# Altium schematic sheet DCDC.schdoc: =
size A3; Symbol: Sheet-Symbol_A4; Company: 嘉立创EDA; Version: V1.0; Page Size: A4; @Project Name: RK3568B2地瓜派; @Page Count: 27; @Update Date: 2025-09-13; @Create Date: 2025-09-11; @Schematic Name: Schematic1; @Page No: 15; @Page Name: DCDC; Device: Sheet-Symbol_A4; Border: 1; Title Block Position: 3; Width: 2338; Height: 1652; Region Start: 1; X Region Count: 6; Y Region Count: 4; Blade Width: 10; @Board Name: Board1; @Create Time: 22:14:46; @Update Time: 14:11:51; Organization: ORGANIZATION; Address1: ADDRESS 1; Address2: ADDRESS 2; Address3: ADDRESS 3; Address4: ADDRESS 4; SheetNumber: 5; SheetTotal: 28
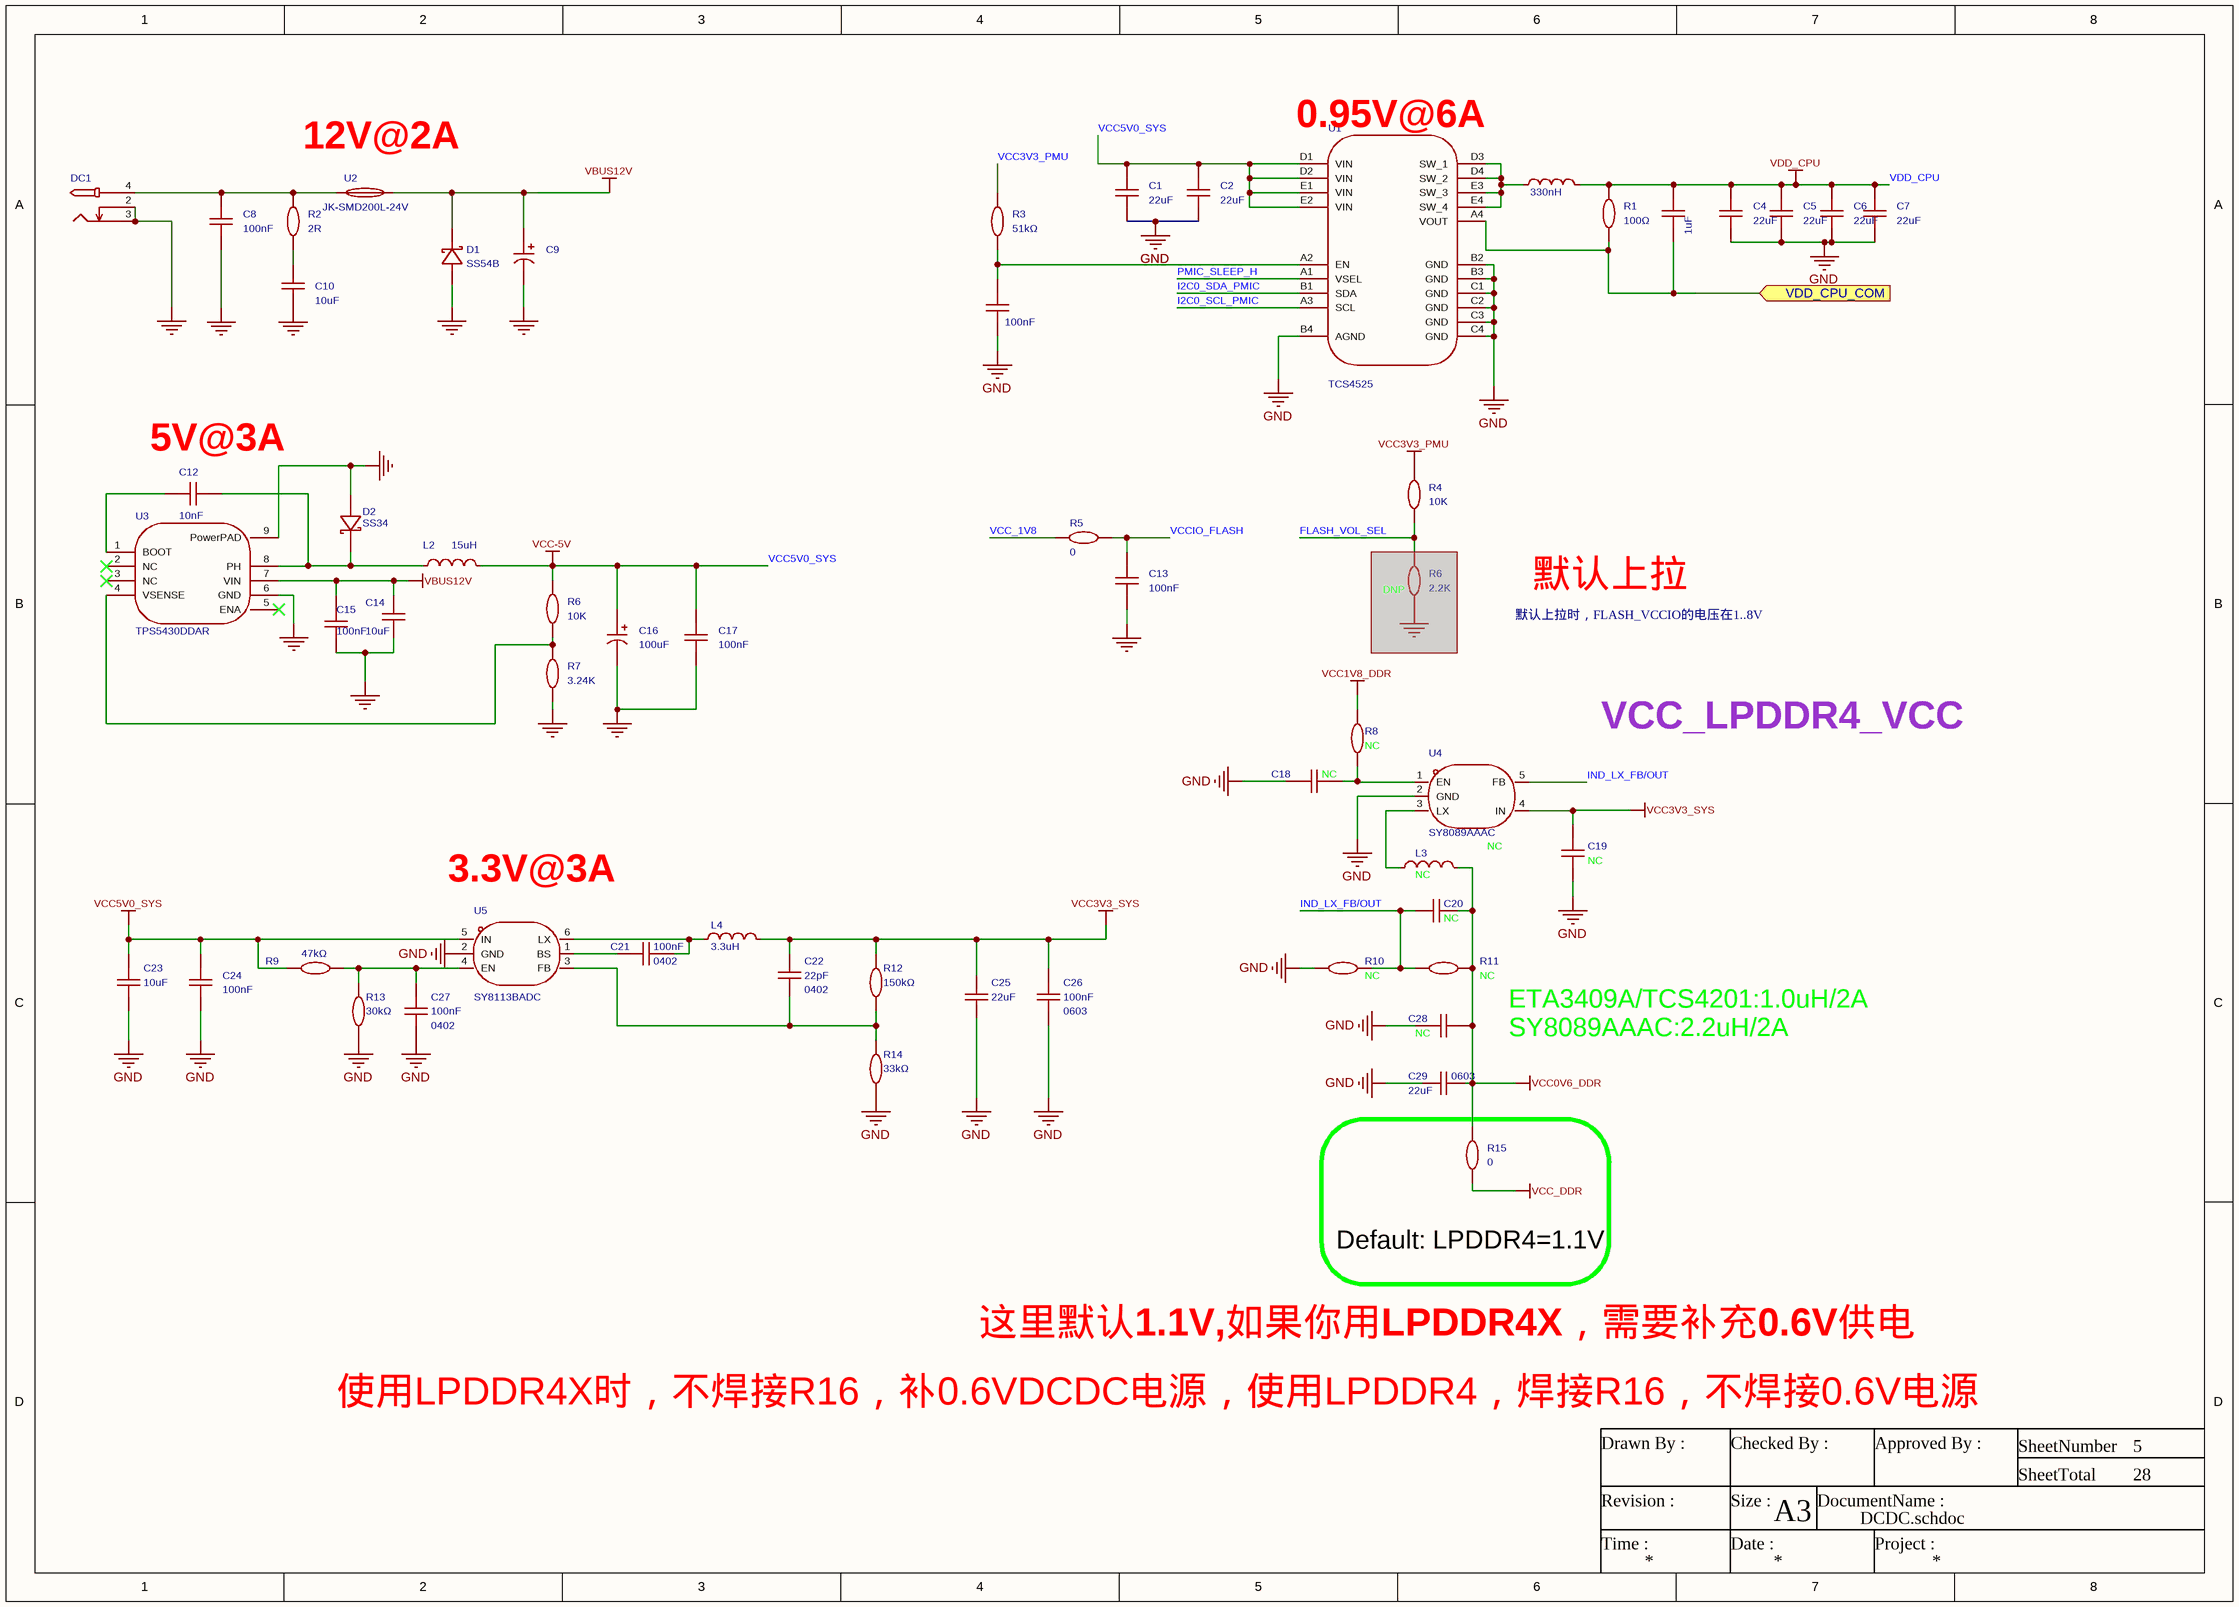
[diagram p0: DCDC.schdoc]

## Parts
(Parts that share a designator on the sheet are numbered #1, #2 ... from top to bottom, then left to right.)
C1  22uF  [C0805]
C2  22uF  [C0805]
C3  value 1uF  [MYC0402]  (hidden comment: CC0603KRX7R9BB104)
C4  22uF  [C0603]
C5  22uF  [C0603]
C6  22uF  [C0603]
C7  22uF  [C0603]
C8  100nF  [C0603]
C9  100uF  [CAP-SMD_BD6.3-L6.6-W6.6-RD]  (value not drawn)
C10  10uF  [C1206]
C11  value 100nF  [MYC0402]  (hidden comment: CC0603KRX7R9BB104)
C12  10nF  [C0603]
C13  100nF  [C0603]
C14  10uF  [C1206]
C15  100nF  [C1206]
C16  100uF  [CAP-SMD_BD6.3-L6.6-W6.6-RD]
C17  100nF  [C0603]
C18  NC  [R0402]
C19  NC  [R0603]
C20  NC  [R0402]
C21  100nF  Supplier Footprint: 0402  [MYC0402]
C22  22pF  Supplier Footprint: 0402  [R0402]
C23  10uF  [C0603]
C24  100nF  [C0603]
C25  22uF  [C0603]
C26  100nF  Supplier Footprint: 0603  [C0603]
C27  100nF  Supplier Footprint: 0402  [MYC0402]
C28  NC  [R0603]
C29  22uF  Supplier Footprint: 0603  [C0603]
D1  SS54B  [SMB_L4.6-W3.6-LS5.3-RD]
D2  SS34  [SMA_L4.3-W2.6-LS5.0-FD]
DC1  (no value)  [DC-2.0]
L1  330nH  [IND-SMD_L2.5-W2.0_WPN252012H]
L2  15uH  [IND-SMD_L7.3-W6.8]
L3  NC  [IND-SMD_L3.0-W3.0]
L4  3.3uH  [IND-SMD_L4.4-W4.2]
R1  100Ω  [R0402]
R2  2R  [R0603]
R3  51kΩ  [R0402]
R4  10K  [R0402]
R5  0  [R0603]
R6#1  2.2K  [R0201]  (graphical)  (masked out: inside a compile mask, not in the netlist)
R6#2  10K  [R0603]
R7  3.24K  [R0603]
R8  NC  [R0402]
R9  47kΩ  [R0402]
R10  NC  [R0402]
R11  NC  [R0402]
R12  150kΩ  [R0402]
R13  30kΩ  [R0402]
R14  33kΩ  [R0402]
R15  0  [R0603]
U1  TCS4525  [TCS4525]
U2  JK-SMD200L-24V  [F2920]
U3  TPS5430DDAR  [ESOP-8_L4.9-W3.9-P1.27-LS6.0-TL-EP]
U4  SY8089AAAC  [SOT-23-5_L3.0-W1.7-P0.95-LS2.8-BR]
U5  SY8113BADC  [TSOT-23-6_L2.9-W1.6-P0.95-LS2.8-BR]

## Blocks framed on the sheet
Default: LPDDR4=1.1V: R15

## Ports
VDD_CPU_COM (in)

## Nets
GND: C1.1 C2.1 C4.1 C5.1 C6.1 C7.1 C8.1 C9.2 C10.1 C11.1 C13.1 C14.1 C15.1 C16.2 C17.1 C18.2 C19.1 C23.1 C24.1 C25.1 C26.1 C27.1 C28.2 C29.2 D1.2(A) D2.1(A) DC1.2 DC1.3 R7.1 R10.2 R13.1 R14.1 U1.B2(GND) U1.B3(GND) U1.B4(AGND) U1.C1(GND) U1.C2(GND) U1.C3(GND) U1.C4(GND) U3.6(GND) U3.9(PowerPAD) U4.2(GND) U5.2(GND)
VBUS12V: C9.1 C14.2 C15.2 D1.1(K) U2.2 U3.7(VIN)
VCC0V6_DDR: C20.2 C28.1 C29.1 L3.2 R11.1 R15.2
VCC1V8_DDR: R8.2
VCC3V3_PMU: R3.2 R4.2
VCC3V3_SYS: C19.2 C22.2 C25.2 C26.2 L4.2 R12.2 U4.4(IN)
VCC5V0_SYS: C1.2 C2.2 C16.1 C17.2 C23.2 C24.2 L2.2 R6#2.2 R9.2 U1.D1(VIN) U1.D2(VIN) U1.E1(VIN) U1.E2(VIN) U5.5(IN)  [also labelled VCC-5V]
VCC_DDR: R15.1
VDD_CPU: C3.2 C4.2 C5.2 C6.2 C7.2 L1.2 R1.2
FLASH_VOL_SEL: R4.1
I2C0_SCL_PMIC: U1.A3(SCL)
I2C0_SDA_PMIC: U1.B1(SDA)
IND_LX_FB/OUT: C20.1 R10.1 R11.2 U4.5(FB)
PMIC_SLEEP_H: U1.A1(VSEL)
VCC_1V8: R5.1
VCCIO_FLASH: C13.2 R5.2
VDD_CPU_COM: C3.1 R1.1 U1.A4(VOUT) ; port VDD_CPU_COM
NetC8_2: C8.2 DC1.4 R2.2 U2.1
NetC10_2: C10.2 R2.1
NetC11_2: C11.2 R3.1 U1.A2(EN)
NetC12_1: C12.1 U3.1(BOOT)
NetC12_2: C12.2 D2.2(K) L2.1 U3.8(PH)
NetC18_1: C18.1 R8.1 U4.1(EN)
NetC21_1: C21.1 L4.1 U5.6(LX)
NetC21_2: C21.2 U5.1(BS)
NetC22_1: C22.1 R12.1 R14.2 U5.3(FB)
NetC27_2: C27.2 R9.1 R13.2 U5.4(EN)
NetL1_1: L1.1 U1.D3(SW_1) U1.D4(SW_2) U1.E3(SW_3) U1.E4(SW_4)
NetL3_1: L3.1 U4.3(LX)
NetR6#2_1: R6#2.1 R7.2 U3.4(VSENSE)

Not connected (* = marked no-connect by the designer): U3 2(NC)* 3(NC)* 5(ENA)*

## Notes on the sheet
- (near U2) 12V@2A
- (near U1) 0.95V@6A
- (near C12) 5V@3A
- 默认上拉
- (near R6#1) DNP
- 默认上拉时，FLASH_VCCIO的电压在1..8V
- VCC_LPDDR4_VCC
- 3.3V@3A
- NC
- ETA3409A/TCS4201:1.0uH/2A
  SY8089AAAC:2.2uH/2A
- 这里默认1.1V,如果你用LPDDR4X，需要补充0.6V供电
- 使用LPDDR4X时，不焊接R16，补0.6VDCDC电源，使用LPDDR4，焊接R16，不焊接0.6V电源
- Drawn By :
- Checked By :
- Approved By :
- SheetNumber
- SheetTotal
- Revision :
- Time :
- Size :
- Date :
- A3
- DocumentName :
- Project :

## Library data of the parts
C1 C2 = CAP_0805: Symbol: Capacitance; ConvertToPcb: yes; ModelId: 1ba041120af144c991958decab20d241聨0819f05c4eef4c71ace90d822a990e87; ModelName: C0805_L2.0-W1.3-H1.3; ModelTransform: 78.74,51.181,0,0,0,0,0,0.0005,0; Device: CAP_0805; Value: 22uF; AddInBom: yes; Supplier Footprint: 0805; FootprintName: C0805
C3 C11 = CC0603KRX7R9BB104: 容值:100nF;精度:±10%;额定电压:50V;材质(温度系数):X7R;; Manufacturer: YAGEO(国巨); Symbol: CapAcitance; AddInBom: yes; ModelId: ac125912035d415993ca9572d50418b1; ModelName: C0603_L1.6-W0.8-H0.8; ModelTransform: 62.992,31.496,0,0,0,0,0,0,0; Tolerance: ±10%; Voltage Rated: 50V; Temperature Coefficient: X7R; Device: CC0603KRX7R9BB104; LCSC Part Name: 100nF ±10% 50V; ManufacturerPart: CC0603KRX7R9BB104; Supplier Footprint: 0603; JLCPCB Part Class: Basic Part; Datasheet: https://atta.szlcsc.com/upload/public/pdf/source/20180910/C282072_33301C7F631E79921B82A8DAC6BCC5B3.pdf; Supplier: LCSC; ConvertToPcb: yes; FootprintName: MYC0402
  C11: SupplierPart: C14663
C4-C7 = CAP_0603: Symbol: Capacitance; ConvertToPcb: yes; ModelId: ac125912035d415993ca9572d50418b1聨0819f05c4eef4c71ace90d822a990e87; ModelName: C0603_L1.6-W0.8-H0.8; ModelTransform: 62.992,31.496,0,0,0,0,0,0,0; Device: CAP_0603; Value: 22uF; AddInBom: yes; Supplier Footprint: 0603; FootprintName: C0603
C8 C13 C15 C17 = CAP_0603: ConvertToPcb: yes; SymbolName: Capacitance; ModelId: ac125912035d415993ca9572d50418b1; ModelName: C0603_L1.6-W0.8-H0.8; ModelTransform: 62.992,31.496,0,0,0,0,0,0,0; Device: CAP_0603; AddInBom: yes; Supplier Footprint: 0603; Value: 100nF
  C8 C13 C17: FootprintName: C0603
  C15: FootprintName: C1206
C9 C16 = MA35V100M6X8: 容值:100uF;精度:±20%;额定电压:35V;纹波电流:2.9A@100kHz;等效串联电阻(ESR):30mΩ@100kHz;类型:聚合物;; Manufacturer: 捷而瑞; AddInBom: yes; ModelId: 901941a22e384f799727a46cfda77174; ModelName: CAP-SMD_L6.6-W6.6-H7.0-LS7.2; ModelTransform: 307.086,259.842,0,0,0,0,0,0,0; Tolerance: ±20%; Voltage Rating: 35V; Type: 聚合物; Lifetime: 2000hrs@105℃; Symbol: MA35V100M6X8; Device: MA35V100M6X8; LCSC Part Name: 100uF ±20% 35V; SupplierPart: C46550467; ManufacturerPart: MA35V100M6X8; Supplier Footprint: SMD,D6.3xL7.7mm; JLCPCB Part Class: 扩展库; Datasheet: https://item.szlcsc.com/datasheet/MA35V100M6X8/48680161.html; Supplier: LCSC; ConvertToPcb: yes; FootprintName: CAP-SMD_BD6.3-L6.6-W6.6-RD; Value: 100uF; Ripple Current: 2.9A@100kHz; Equivalent Series Resistance(ESR): 30mΩ@100kHz; Diameter: 6.3mm; Height - Seated (Max): 7mm; Operating Temperature: -55℃~+105℃
C10 C14 = CL31A106KBHNNNE: 容值:10uF;精度:±10%;额定电压:50V;温度系数:X5R;; Manufacturer: SAMSUNG(三星); AddInBom: yes; ModelId: e4be705b945545a48e666415e3682bd8; ModelName: C1206_L3.2-W1.6-H1.3; ModelTransform: 125.984,62.992,0,0,0,0,0,0,0; Tolerance: ±10%; Voltage Rating: 50V; Temperature Coefficient: X5R; Symbol: CL31A106KBHNNNE; Device: CL31A106KBHNNNE; LCSC Part Name: 10uF ±10% 50V; SupplierPart: C13585; ManufacturerPart: CL31A106KBHNNNE; Supplier Footprint: 1206; JLCPCB Part Class: 基础库; Datasheet: https://item.szlcsc.com/datasheet/CL31A106KBHNNNE/14236.html; Supplier: LCSC; ConvertToPcb: yes; FootprintName: C1206; Value: 10uF
C12 C24 = CAP_0603: Symbol: CapAcitance; ConvertToPcb: yes; ModelId: ac125912035d415993ca9572d50418b1; ModelName: C0603_L1.6-W0.8-H0.8; ModelTransform: 62.992,31.496,0,0,0,0,0,0,0; Device: CAP_0603; AddInBom: yes; Supplier Footprint: 0603; FootprintName: C0603
  C12: Value: 10nF
  C24: Value: 100nF
C18 = CL05B104KB54PNC: 容值:100nF;精度:±10%;额定电压:50V;材质(温度系数):X7R;; Manufacturer: SAMSUNG(三星); Add into BOM: no; ConvertToPcb: yes; ModelId: 36a51122f27c49738f86b3bfa98863e0; ModelName: C0402_L1.0-W0.5-H0.5; ModelTransform: 39.37,19.685,0,0,0,0,0,0,0; Tolerance: ±10%; Voltage Rated: 50V; Temperature Coefficient: X7R; Symbol: CL05B104KB54PNC; Supplier Part: NC; Value: NC; Device: CL05B104KB54PNC; LCSC Part Name: 100nF ±10% 50V; ManufacturerPart: CL05B104KB54PNC; Supplier Footprint: 0402; JLCPCB Part Class: Basic Part; Datasheet: https://atta.szlcsc.com/upload/public/pdf/source/20181009/C307331_222F7C870FD3EA5F46F538B483443886.pdf; Supplier: LCSC; FootprintName: R0402
C19 C28 = 0603X106M100CT: 容值:10uF;精度:±20%;额定电压:10V;材质(温度系数):X5R;; Manufacturer: Walsin(华新科); Add into BOM: no; ConvertToPcb: yes; ModelId: ac125912035d415993ca9572d50418b1; ModelName: C0603_L1.6-W0.8-H0.8; ModelTransform: 62.992,31.496,0,0,0,0,0,0,0; Tolerance: ±20%; Voltage Rated: 10V; Temperature Coefficient: X5R; Supplier Part: NC; Value: NC; Device: 0603X106M100CT; Symbol: 0603X106M100; LCSC Part Name: 10uF ±20% 10V; ManufacturerPart: 0603X106M100CT; Supplier Footprint: 0603; JLCPCB Part Class: 扩展库; Datasheet: https://atta.szlcsc.com/upload/public/pdf/source/20161226/1482720147964.pdf; Supplier: LCSC; FootprintName: R0603
C20 = 0402CG101J500NT: 容值:100pF;精度:±5%;额定电压:50V;材质(温度系数):C0G;; Manufacturer: FH(风华); Add into BOM: no; ConvertToPcb: yes; ModelId: 36a51122f27c49738f86b3bfa98863e0; ModelName: C0402_L1.0-W0.5-H0.5; ModelTransform: 39.37,19.685,0,0,0,0,0,0,0; Tolerance: ±5%; Voltage Rated: 50V; Temperature Coefficient: C0G; Supplier Part: NC; Value: NC; Device: 0402CG101J500NT; Symbol: 0402CG101J500NT; LCSC Part Name: 100pF ±5% 50V; ManufacturerPart: 0402CG101J500NT; Supplier Footprint: 0402; JLCPCB Part Class: Basic Part; Datasheet: https://atta.szlcsc.com/upload/public/pdf/source/20170923/C1546_1506149265265988353.pdf; Supplier: LCSC; FootprintName: R0402
C21 C27 = CL05B104KB54PNC: 容值:100nF;精度:±10%;额定电压:50V;材质(温度系数):X7R;; Manufacturer: SAMSUNG(三星); AddInBom: yes; ModelId: 36a51122f27c49738f86b3bfa98863e0; ModelName: C0402_L1.0-W0.5-H0.5; ModelTransform: 39.37,19.685,0,0,0,0,0,0,0; Tolerance: ±10%; Voltage Rated: 50V; Temperature Coefficient: X7R; Symbol: CL05B104KB54PNC; Device: CL05B104KB54PNC; LCSC Part Name: 100nF ±10% 50V; SupplierPart: C307331; ManufacturerPart: CL05B104KB54PNC; JLCPCB Part Class: Basic Part; Datasheet: https://atta.szlcsc.com/upload/public/pdf/source/20181009/C307331_222F7C870FD3EA5F46F538B483443886.pdf; Supplier: LCSC; ConvertToPcb: yes; FootprintName: MYC0402; Value: 100nF
C22 = 0402CG220J500NT: 容值:22pF;精度:±5%;额定电压:50V;材质(温度系数):C0G;; Manufacturer: FH(风华); AddInBom: yes; ModelId: 36a51122f27c49738f86b3bfa98863e0; ModelName: C0402_L1.0-W0.5-H0.5; ModelTransform: 39.37,19.685,0,0,0,0,0,0,0; Tolerance: ±5%; Voltage Rated: 50V; Temperature Coefficient: C0G; Device: 0402CG220J500NT; Symbol: 0402CG220J500NT; LCSC Part Name: 22pF ±5% 50V; SupplierPart: C1555; ManufacturerPart: 0402CG220J500NT; JLCPCB Part Class: Basic Part; Datasheet: https://atta.szlcsc.com/upload/public/pdf/source/20170923/C1555_1506149269156988362.pdf; Supplier: LCSC; ConvertToPcb: yes; FootprintName: R0402; Value: 22pF
C23 = CL10A106KP8NNNC: 容值:10uF;精度:±10%;额定电压:10V;材质(温度系数):X5R;; Manufacturer: SAMSUNG(三星); Symbol: 0603X106M100; AddInBom: yes; ModelId: ac125912035d415993ca9572d50418b1; ModelName: C0603_L1.6-W0.8-H0.8; ModelTransform: 62.992,31.496,0,0,0,0,0,0,0; Tolerance: ±10%; Voltage Rated: 10V; Temperature Coefficient: X5R; Device: CL10A106KP8NNNC; LCSC Part Name: 10uF ±10% 10V; SupplierPart: C19702; ManufacturerPart: CL10A106KP8NNNC; Supplier Footprint: 0603; JLCPCB Part Class: Basic Part; Datasheet: https://atta.szlcsc.com/upload/public/pdf/source/20160103/1457707703378.pdf; Supplier: LCSC; ConvertToPcb: yes; FootprintName: C0603; Value: 10uF
C25 = CL10A226MQ8NRNC: 容值:22uF;精度:±20%;额定电压:6.3V;材质(温度系数):X5R;; Manufacturer: SAMSUNG(三星); Symbol: GRT188R61A226ME13D; AddInBom: yes; ModelId: ac125912035d415993ca9572d50418b1; ModelName: C0603_L1.6-W0.8-H0.8; ModelTransform: 62.992,31.496,0,0,0,0,0,0,0; Tolerance: ±20%; Voltage Rated: 6.3V; Temperature Coefficient: X5R; Device: CL10A226MQ8NRNC; LCSC Part Name: 22uF ±20% 6.3V; SupplierPart: C59461; ManufacturerPart: CL10A226MQ8NRNC; Supplier Footprint: 0603; JLCPCB Part Class: Basic Part; Datasheet: https://atta.szlcsc.com/upload/public/pdf/source/20160218/1457707763339.pdf; Supplier: LCSC; ConvertToPcb: yes; FootprintName: C0603; Value: 22uF
C26 = CC0603KRX7R9BB104: 容值:100nF;精度:±10%;额定电压:50V;材质(温度系数):X7R;; Manufacturer: YAGEO(国巨); AddInBom: yes; ModelId: ac125912035d415993ca9572d50418b1; ModelName: C0603_L1.6-W0.8-H0.8; ModelTransform: 62.992,31.496,0,0,0,0,0,0,0; Tolerance: ±10%; Voltage Rated: 50V; Temperature Coefficient: X7R; Symbol: CC0603KRX7R9BB104; Supplier Part: C14663; Device: CC0603KRX7R9BB104; LCSC Part Name: 100nF ±10% 50V; ManufacturerPart: CC0603KRX7R9BB104; JLCPCB Part Class: Basic Part; Datasheet: https://atta.szlcsc.com/upload/public/pdf/source/20180910/C282072_33301C7F631E79921B82A8DAC6BCC5B3.pdf; Supplier: LCSC; ConvertToPcb: yes; FootprintName: C0603; Value: 100nF
C29 = CL10A226MQ8NRNC: 容值:22uF;精度:±20%;额定电压:6.3V;材质(温度系数):X5R;; Manufacturer: SAMSUNG(三星); Symbol: GRT188R61A226ME13D; Add into BOM: yes; ModelId: ac125912035d415993ca9572d50418b1; ModelName: C0603_L1.6-W0.8-H0.8; ModelTransform: 62.992,31.496,0,0,0,0,0,0,0; Tolerance: ±20%; Voltage Rated: 6.3V; Temperature Coefficient: X5R; Device: CL10A226MQ8NRNC; LCSC Part Name: 22uF ±20% 6.3V; SupplierPart: C59461; ManufacturerPart: CL10A226MQ8NRNC; JLCPCB Part Class: Basic Part; Datasheet: https://atta.szlcsc.com/upload/public/pdf/source/20160218/1457707763339.pdf; Supplier: LCSC; ConvertToPcb: yes; FootprintName: C0603; Value: 22uF
D1 = SS54B_C18199181: 二极管配置:独立式;正向压降(Vf):550mV@5.0A;直流反向耐压(Vr):40V;整流电流:5A;; Manufacturer: 宏嘉诚; AddInBom: yes; ModelId: 892cc756ed79448ab4afad0e5bfcdfa6; ModelTransform: 212.598,141.732,0,0,0,0,0,0,0; Diode Configuration: 独立式; Voltage - DC Reverse(Vr): 40V; Current - Rectified: 5A; Reverse Leakage Current (Ir): 200uA@40V; Operating Junction Temperature Range: -55℃~+125℃; Non-Repetitive Peak Forward Surge Current: 120A; Symbol: SS54B_C18199181; Device: SS54B_C18199181; LCSC Part Name: 电压:40V 电流:5A; SupplierPart: C18199181; ManufacturerPart: SS54B; Supplier Footprint: SMB; JLCPCB Part Class: 扩展库; Datasheet: https://item.szlcsc.com/datasheet/SS54B/19354413.html; Supplier: LCSC; ConvertToPcb: yes; FootprintName: SMB_L4.6-W3.6-LS5.3-RD; ModelName: SMB_L4.6-W3.6-LS5.3-RD; Voltage - Forward(Vf@If): 550mV@5.0A
D2 = SS34_C7420365: 二极管配置:独立式;正向压降(Vf):550mV@3.0A;直流反向耐压(Vr):40V;平均整流电流(Io):3A;; Manufacturer: 宏迦橙; AddInBom: yes; ModelId: 7e24bebe6cd74171ae8c9de6fc5b78aa; ModelTransform: 198.4248,103.5431,0,180,0,0,0,0,0; Diode Configuration: 独立式; Reverse Voltage (Vr): 40V; Average Rectified Current (Io): 3A; Reverse Leakage Current (Ir): 200uA@40V; Peak forward surge current: 80A; Symbol: SS34_C7420365; Device: SS34_C7420365; LCSC Part Name: 电压:40V 电流:3A; SupplierPart: C7420365; ManufacturerPart: SS34; Supplier Footprint: SMA(DO-214AC); JLCPCB Part Class: 扩展库; Datasheet: https://atta.szlcsc.com/upload/public/pdf/source/20230828/75438452AEE6C276EDA92B2AF599BE05.pdf; Supplier: LCSC; ConvertToPcb: yes; FootprintName: SMA_L4.3-W2.6-LS5.0-FD; ModelName: SMA_L4.3-W2.6-LS5.0-FD; Forward Voltage (Vf@If): 550mV@3.0A
DC1 = DC-005_2.0: ConvertToPcb: yes; SymbolName: DC电源接口; ModelId: f5f20b8a2308479b936ba3c2698865bb聨0819f05c4eef4c71ace90d822a990e87; ModelName: DC-IN-TH_DC-5520-1; ModelTransform: 372.05,551.18,582.68,90,0,0,137.8,0,-149.61; Device: DC-005_2.0; AddInBom: yes; Supplier Footprint: 插件; FootprintName: DC-2.0
L1 = WPN252012HR24MT: Manufacturer: Sunlord(顺络); AddInBom: yes; ModelId: 7ae8e774cfcf498ea5119a488d0de531; ModelName: IND-SMD_L2.5-W2.0-H1.2-252012; ModelTransform: 78.74,99.2124,0,90,0,0,0,0,0; Device: WPN252012HR24MT; Symbol: WPN252012HR24MT; LCSC Part Name: 240nH ±20%; SupplierPart: C305274; ManufacturerPart: WPN252012HR24MT; Supplier Footprint: SMD,2.5x2.0x1.2mm; JLCPCB Part Class: Extended Part; Supplier: LCSC; ConvertToPcb: yes; FootprintName: IND-SMD_L2.5-W2.0_WPN252012H
L2 = FXL0630-100-M: 电感值:10uH;精度:±20%;额定电流:4.5A;饱和电流(Isat):5.5A;类型:一体成型电感;; Manufacturer: cjiang(长江微电); AddInBom: yes; ModelId: e28854526ca747668ea12fbe1dd39a63; ModelName: IND-SMD_L7.3-W6.8-H3.0; ModelTransform: 292.125,267.716,0,0,0,0,0,0,0; Tolerance: ±20%; Rated Current: 4.5A; Saturation Current (Isat): 5.5A; DC Resistance (DCR): 68mΩ; Type: 一体成型电感; Symbol: FXL0630-100-M; Value: 15uH; Device: FXL0630-100-M; LCSC Part Name: 10uH ±20% 5.5A; ManufacturerPart: FXL0630-100-M; Supplier Footprint: SMD,6.6x7mm; JLCPCB Part Class: 扩展库; Datasheet: https://atta.szlcsc.com/upload/public/pdf/source/20240426/3189EA8206330E2108542F9E34E540E7.pdf; Supplier: LCSC; ConvertToPcb: yes; FootprintName: IND-SMD_L7.3-W6.8; Ratings: -
L3 = SWPA3015S2R2MT: 电感值:2.2uH;精度:±20%;额定电流:2A;直流电阻(DCR):-;; Manufacturer: Sunlord(顺络); Add into BOM: no; ConvertToPcb: yes; ModelId: 67451da4701445baa335959290a67a23; ModelName: IND-SMD_L3.0-W3.0-H1.5; ModelTransform: 118.11,118.8974,0,90,0,0,0,0,0; Tolerance: ±20%; Rated Current: 2A; Supplier Part: NC; Value: NC; Device: SWPA3015S2R2MT; Symbol: SWPA3015S2R2MT; LCSC Part Name: 2.2uH ±20% 2A; ManufacturerPart: SWPA3015S2R2MT; Supplier Footprint: SMD; JLCPCB Part Class: Extended Part; Datasheet: https://atta.szlcsc.com/upload/public/pdf/source/20210916/AC798BA7E846B7D0B6818F45CD84DB0B.pdf; Supplier: LCSC; FootprintName: IND-SMD_L3.0-W3.0; DC Resistance (DCR): -
L4 = MWSA0402S-3R3MT: 额定电流:3.3A;精度:±20%;电感值:3.3uH;直流电阻(DCR):87mΩ;; Manufacturer: Sunlord(顺络); Symbol: SWPA4030S4R7MT; AddInBom: yes; ModelId: e9b3d3f4fa134185b54d517730715f16; ModelName: IND-SMD_L4.2-W4.4-H2.0; ModelTransform: 173.228,165.354,0,0,0,0,0,0,0; Rated Current: 3.3A; Tolerance: ±20%; DC Resistance (DCR): 87mΩ; Device: MWSA0402S-3R3MT; LCSC Part Name: 3.3uH ±20%; SupplierPart: C408336; ManufacturerPart: MWSA0402S-3R3MT; Supplier Footprint: SMD; JLCPCB Part Class: Extended Part; Datasheet: https://atta.szlcsc.com/upload/public/pdf/source/20190729/C408336_17B5BB1DF2845DE8F323BD9CE9EEFEBA.pdf; Supplier: LCSC; ConvertToPcb: yes; FootprintName: IND-SMD_L4.4-W4.2; Height: 2mm; Width: 4.4mm; Value: 3.3uH; Length: 4.2mm
R1 R3 = Res_0402: Symbol: 电阻; ConvertToPcb: yes; ModelId: 671aefced39d4c318694bba8bd8efd39; ModelName: R0402_L1.0-W0.5-H0.5; ModelTransform: 39.37,19.685,0,0,0,0,0,0.0005,0; Device: Res_0402; AddInBom: yes; Supplier Footprint: 0402; FootprintName: R0402
  R1: Value: 100Ω
  R3: Value: 51kΩ
R2 R5 R6#2 R7 = Res_0603: Symbol: 电阻; ConvertToPcb: yes; ModelId: fc143cca1e79419f9cd78b61e9279f08; ModelTransform: 31.8897,63.7794,0,90,0,0,0,0,0; Device: Res_0603; AddInBom: yes; Supplier Footprint: 0603; FootprintName: R0603; ModelName: R0603
  R2: Value: 2R
  R5: Value: 0
  R6#2: Value: 10K
  R7: Value: 3.24K
R4 = Res_0402: Symbol: 电阻; 3D Model: 671aefced39d4c318694bba8bd8efd39; 3D Model Transform: 39.37,19.685,0,0,0,0,0,0.0005,0; ConvertToPcb: yes; ModelName: R0402_L1.0-W0.5-H0.5; Device: Res_0402; Supplier Footprint: 0402; Value: 10K; AddInBom: yes; FootprintName: R0402
R6#1 = Res_0201: Add into BOM: no; SymbolName: 电阻; ModelId: 0e006ba4c37b4b73b0e85d5d1c6800cb; ModelName: R0201_L0.6-W0.3-H0.3; ModelTransform: 23.622,11.811,0,0,0,0,0,-0.0005,0; Value: 2.2K; Device: Res_0201; Convert to PCB: no; Supplier Footprint: 0201; FootprintName: R0201
R8 = 0402WGF2002TCE: 电阻类型:厚膜电阻;阻值:20kΩ;精度:±1%;功率:62.5mW;温度系数:±100ppm/℃;最大工作电压:50V;工作温度范围:-55℃~+155℃;; Manufacturer: UNI-ROYAL(厚声); Add into BOM: no; ConvertToPcb: yes; ModelId: 671aefced39d4c318694bba8bd8efd39; ModelName: R0402_L1.0-W0.5-H0.5; ModelTransform: 39.37,19.685,0,0,0,0,0,0.0005,0; Tolerance: ±1%; Power(Watts): 62.5mW; Overload Voltage (Max): 50V; Supplier Part: NC; Value: NC; Device: 0402WGF2002TCE; Symbol: 0402WGF2002TCE; LCSC Part Name: 20kΩ ±1% 62.5mW; ManufacturerPart: 0402WGF2002TCE; Supplier Footprint: 0402; JLCPCB Part Class: Basic Part; Datasheet: https://atta.szlcsc.com/upload/public/pdf/source/20200306/C422600_1E6D84923E4A46A82E41ADD87F860B5C.pdf; Supplier: LCSC; FootprintName: R0402; Type: 厚膜电阻; Temperature Coefficient: ±100ppm/℃; Operating Temperature Range: -55℃~+155℃
R9 = 0402WGF4702TCE: 电阻类型:厚膜电阻;阻值:47kΩ;精度:±1%;功率:62.5mW;; Manufacturer: UNI-ROYAL(厚声); Symbol: 0402WGF1003TCE; AddInBom: yes; ModelId: 671aefced39d4c318694bba8bd8efd39; ModelName: R0402_L1.0-W0.5-H0.5; ModelTransform: 39.37,19.685,0,0,0,0,0,0.0005,0; Tolerance: ±1%; Power(Watts): 62.5mW; Temperature Coefficient: ±100ppm/℃; Overload Voltage (Max): 50V; Device: 0402WGF4702TCE; LCSC Part Name: 47kΩ ±1% 62.5mW; SupplierPart: C25792; ManufacturerPart: 0402WGF4702TCE; Supplier Footprint: 0402; JLCPCB Part Class: Basic Part; Datasheet: https://atta.szlcsc.com/upload/public/pdf/source/20200306/C422600_1E6D84923E4A46A82E41ADD87F860B5C.pdf; Supplier: LCSC; ConvertToPcb: yes; FootprintName: R0402; Type: 厚膜电阻; Value: 47kΩ; Operating Temperature Range: -55℃~+155℃
R10 = 0402WGF1003TCE: 电阻类型:厚膜电阻;阻值:100kΩ;精度:±1%;功率:62.5mW;温度系数:±100ppm/℃;最大工作电压:50V;工作温度范围:-55℃~+155℃;; Manufacturer: UNI-ROYAL(厚声); Add into BOM: no; ConvertToPcb: yes; ModelId: 671aefced39d4c318694bba8bd8efd39; ModelName: R0402_L1.0-W0.5-H0.5; ModelTransform: 39.37,19.685,0,0,0,0,0,0.0005,0; Tolerance: ±1%; Power(Watts): 62.5mW; Overload Voltage (Max): 50V; Supplier Part: NC; Value: NC; Device: 0402WGF1003TCE; Symbol: 0402WGF1003TCE; LCSC Part Name: 100kΩ ±1% 62.5mW; ManufacturerPart: 0402WGF1003TCE; Supplier Footprint: 0402; JLCPCB Part Class: Basic Part; Datasheet: https://atta.szlcsc.com/upload/public/pdf/source/20200306/C422600_1E6D84923E4A46A82E41ADD87F860B5C.pdf; Supplier: LCSC; FootprintName: R0402; Type: 厚膜电阻; Temperature Coefficient: ±100ppm/℃; Operating Temperature Range: -55℃~+155℃
R11 = 0402WGF2001TCE: 电阻类型:厚膜电阻;阻值:2kΩ;精度:±1%;功率:62.5mW;温度系数:±100ppm/℃;最大工作电压:50V;工作温度范围:-55℃~+155℃;; Manufacturer: UNI-ROYAL(厚声); Add into BOM: no; ConvertToPcb: yes; ModelId: 671aefced39d4c318694bba8bd8efd39; ModelName: R0402_L1.0-W0.5-H0.5; ModelTransform: 39.37,19.685,0,0,0,0,0,0.0005,0; Tolerance: ±1%; Power(Watts): 62.5mW; Overload Voltage (Max): 50V; Supplier Part: NC; Value: NC; Device: 0402WGF2001TCE; Symbol: 0402WGF2001TCE; LCSC Part Name: 2kΩ ±1% 62.5mW; ManufacturerPart: 0402WGF2001TCE; Supplier Footprint: 0402; JLCPCB Part Class: Basic Part; Datasheet: https://atta.szlcsc.com/upload/public/pdf/source/20200306/C422600_1E6D84923E4A46A82E41ADD87F860B5C.pdf; Supplier: LCSC; FootprintName: R0402; Type: 厚膜电阻; Temperature Coefficient: ±100ppm/℃; Operating Temperature Range: -55℃~+155℃
R12 = RC0402FR-07232KL: 电阻类型:厚膜电阻;阻值:232kΩ;精度:±1%;功率:62.5mW;; Manufacturer: YAGEO(国巨); Symbol: 0402WGF2323TCE; AddInBom: yes; ModelId: 671aefced39d4c318694bba8bd8efd39; ModelName: R0402_L1.0-W0.5-H0.5; ModelTransform: 39.37,19.685,0,0,0,0,0,0.0005,0; Tolerance: ±1%; Power(Watts): 62.5mW; Temperature Coefficient: ±100ppm/℃; Overload Voltage (Max): 50V; Value: 150kΩ; Device: RC0402FR-07232KL; LCSC Part Name: 232kΩ ±1% 62.5mW; ManufacturerPart: RC0402FR-07232KL; Supplier Footprint: 0402; JLCPCB Part Class: Extended Part; Datasheet: https://atta.szlcsc.com/upload/public/pdf/source/20181009/C309542_CA3F4488430805647C87B9489F02B718.pdf; Supplier: LCSC; ConvertToPcb: yes; FootprintName: R0402; Type: 厚膜电阻; Operating Temperature Range: -55℃~+155℃
R13 = RC0402FR-0730KL: 电阻类型:厚膜电阻;阻值:30kΩ;精度:±1%;功率:62.5mW;; Manufacturer: YAGEO(国巨); Symbol: 0402WGF5102TCE; AddInBom: yes; ModelId: 671aefced39d4c318694bba8bd8efd39; ModelName: R0402_L1.0-W0.5-H0.5; ModelTransform: 39.37,19.685,0,0,0,0,0,0.0005,0; Tolerance: ±1%; Power(Watts): 62.5mW; Temperature Coefficient: ±100ppm/℃; Overload Voltage (Max): 50V; Device: RC0402FR-0730KL; Value: 30kΩ; LCSC Part Name: 30kΩ ±1% 62.5mW; SupplierPart: C138008; ManufacturerPart: RC0402FR-0730KL; Supplier Footprint: 0402; JLCPCB Part Class: Extended Part; Datasheet: https://atta.szlcsc.com/upload/public/pdf/source/20171107/C138008_15100516356731096935.pdf; Supplier: LCSC; ConvertToPcb: yes; FootprintName: R0402; Type: 厚膜电阻; Operating Temperature Range: -55℃~+155℃
R14 = 0402WGF5102TCE: 电阻类型:厚膜电阻;阻值:51kΩ;精度:±1%;功率:62.5mW;; Manufacturer: UNI-ROYAL(厚声); Tolerance: ±1%; Power(Watts): 62.5mW; Temperature Coefficient: ±100ppm/℃; Overload Voltage (Max): 50V; Symbol: RTT025002FTH; AddInBom: yes; ModelId: 671aefced39d4c318694bba8bd8efd39; ModelName: R0402_L1.0-W0.5-H0.5; ModelTransform: 39.37,19.685,0,0,0,0,0,0.0005,0; LCSC Part Name: 51kΩ ±1% 62.5mW; Datasheet: https://atta.szlcsc.com/upload/public/pdf/source/20200306/C422600_1E6D84923E4A46A82E41ADD87F860B5C.pdf; Type: 厚膜电阻; Value: 33kΩ; Operating Temperature Range: -55℃~+155℃; Device: 0402WGF5102TCE; ManufacturerPart: 0402WGF5102TCE; Supplier Footprint: 0402; JLCPCB Part Class: Basic Part; Supplier: LCSC; ConvertToPcb: yes; FootprintName: R0402
R15 = Res_0603: Symbol: 电阻; ConvertToPcb: yes; ModelId: fc143cca1e79419f9cd78b61e9279f08聨0819f05c4eef4c71ace90d822a990e87; ModelTransform: 31.8897,63.7794,0,90,0,0,0,0,0; Device: Res_0603; Value: 0; AddInBom: yes; Supplier Footprint: 0603; FootprintName: R0603; ModelName: R0603
U1 = TCS4525_WT: 高频，高电流同步降压DC-DC模块; Check: false; AddInBom: yes; Device: TCS4525_WT; ConvertToPcb: yes; SymbolName: TCS4525_WT; FootprintName: TCS4525
U2 = JK-SMD200L-16V: Manufacturer: JK(金科); AddInBom: yes; ModelId: c20979b6eed84fe694c25fdbe1326c05; ModelName: F2920-1; ModelTransform: 289.7632,201.5744,0,0,0,0,0,0,0; Symbol: JK-SMD200L-16V; Manufacturer Part: JK-SMD200L-24V; Device: JK-SMD200L-16V; LCSC Part Name: 贴片保险丝 2920 2A 16V 自恢复保险丝; SupplierPart: C369176; Supplier Footprint: 2920; JLCPCB Part Class: 扩展库; Supplier: LCSC; ConvertToPcb: yes; FootprintName: F2920
U3 = TPS5430DDAR: 功能类型:降压型;输出类型:可调;工作电压:5.5V~36V;输出电压:1.221V~32.04V;输出电流:3A;; Manufacturer: TI(德州仪器); AddInBom: yes; ModelId: 821ddb58f3244ffb9a5d6f8174c5b14e; ModelTransform: 236.22,192.913,0,0,0,0,0,0,0; Function: 降压型; Output Type: 可调; Output Current: 3A; Switching Frequency: 500kHz; Synchronous Rectification: 否; Number of Outputs: 1; Topology: 降压式; Switch tube (built-in/external): 内置; Symbol: TPS5430DDAR; Device: TPS5430DDAR; LCSC Part Name: 宽输入范围、3A输出电流的降压转换器; SupplierPart: C9864; ManufacturerPart: TPS5430DDAR; Supplier Footprint: SOIC-8-EP; JLCPCB Part Class: 基础库; Datasheet: https://www.ti.com/cn/lit/gpn/tps5430; Supplier: LCSC; ConvertToPcb: yes; FootprintName: ESOP-8_L4.9-W3.9-P1.27-LS6.0-TL-EP; ModelName: ESOP-8_L4.9-W3.9-P1.27-LS6.0-TL-EP; Input Voltage: 5.5V~36V; Output Voltage: 1.221V~32.04V; Operating Temperature: -40℃~+125℃@(TJ)
U4 = SY8089AAAC: 功能类型:降压型;同步整流:-;输出通道数:-;拓扑结构:-;输入电压:-;输出电流(最大值):-;开关频率:-;; Manufacturer: silergy(矽力杰); Value: NC; Add into BOM: no; ConvertToPcb: yes; ModelId: 0a2a1b8f50944f73965918ad6e5fe167; ModelName: SOT-23-5_L2.9-W1.6-H1.1-LS2.8-P0.95; ModelTransform: 114.173,109.636,0,180,0,0,-0.863,0.863,0; Function: 降压型; Device: SY8089AAAC; Symbol: SY8089AAAC; LCSC Part Name: 降压型; ManufacturerPart: SY8089AAAC; Supplier Footprint: SOT-23-5; JLCPCB Part Class: Extended Part; Datasheet: https://atta.szlcsc.com/upload/public/pdf/source/20210826/394049C81A2AF57A190C26FDBC282657.pdf; Supplier: LCSC; FootprintName: SOT-23-5_L3.0-W1.7-P0.95-LS2.8-BR; Synchronous Rectification: -; Number of Outputs: -; Topology: -; Input Voltage: -; Output Current (Max): -; Switching Frequency: -
U5 = SY8113BADC: 功能类型:降压型;同步整流:-;输出通道数:-;拓扑结构:-;输入电压:-;输出电流(最大值):-;开关频率:-;; Manufacturer: silergy(矽力杰); AddInBom: yes; Function: 降压型; ModelId: 2c4039b5b88644c1bda4b4ba9e971667; ModelName: TSOT-23-6_L2.9-W1.6-H1.1-LS2.8-P0.95; ModelTransform: 110.45568,114.173,0,180,0,0,-0.005,-0.0005,0; JLCPCB Part Class: Extended Part; Device: SY8113BADC; LCSC Part Name: 降压型; SupplierPart: C78989; ManufacturerPart: SY8113BADC; Supplier Footprint: TSOT-23-6; Datasheet: https://atta.szlcsc.com/upload/public/pdf/source/20161125/1480067827505.pdf; Supplier: LCSC; ConvertToPcb: yes; Synchronous Rectification: -; Number of Outputs: -; Topology: -; Input Voltage: -; Output Current (Max): -; Switching Frequency: -; SymbolName: SY8113BADC; FootprintName: TSOT-23-6_L2.9-W1.6-P0.95-LS2.8-BR